# Altium project sonata-board.PrjPcb (part 3 of 4)

## Sheet sb-sonata-fpgaio2.SchDoc: IO Banks 15 + 16
size Letter; Organization: NewAE Technology Inc.; Address1: 1083 Queen St., Suite 196; Address2: Halifax; Address3: NS; Address4: Canada B3H 0B2; SheetNumber: 13; SheetTotal: 20; SheetApproved: NO
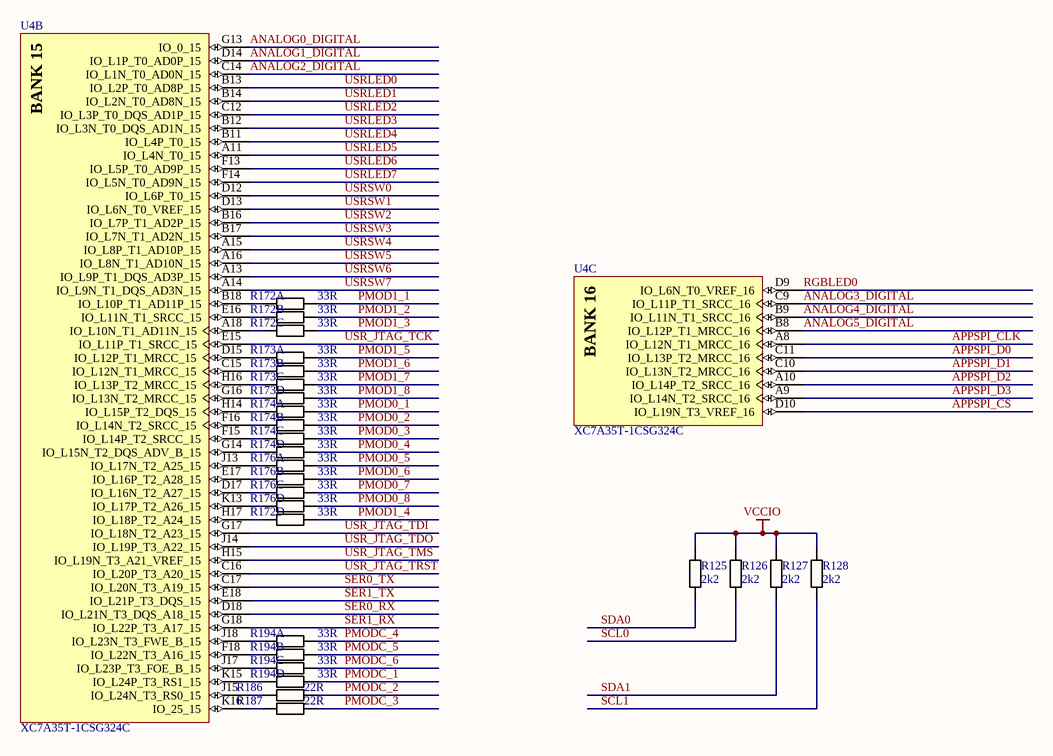
[diagram p12: sb-sonata-fpgaio2.SchDoc]

### Parts
R125  2k2  [RESC1608X55N]
R126  2k2  [RESC1608X55N]
R127  2k2  [RESC1608X55N]
R128  2k2  [RESC1608X55N]
R172  33R  [741C083]  (parts A,B,C,D of 4)
R173  33R  [741C083]  (parts A,B,C,D of 4)
R174  33R  [741C083]  (parts A,B,C,D of 4)
R176  33R  [741C083]  (parts A,B,C,D of 4)
R186  22R  [RESC1005X40N]
R187  22R  [RESC1005X40N]
R194  33R  [741C083]  (parts A,B,C,D of 4)
U4  XC7A35T-1CSG324C  [CSG324]  (parts B,C of 9)

### Nets
VCCIO: R125.1 R126.1 R127.1 R128.1  [project net 3V3_FTDI]
ANALOG0_DIGITAL: U4.G13(IO_0_15)
ANALOG1_DIGITAL: U4.D14(IO_L1P_T0_AD0P_15)
ANALOG2_DIGITAL: U4.C14(IO_L1N_T0_AD0N_15)
ANALOG3_DIGITAL: U4.C9(IO_L11P_T1_SRCC_16)
ANALOG4_DIGITAL: U4.B9(IO_L11N_T1_SRCC_16)
ANALOG5_DIGITAL: U4.B8(IO_L12P_T1_MRCC_16)
APPSPI_CLK: U4.A8(IO_L12N_T1_MRCC_16)
APPSPI_CS: U4.D10(IO_L19N_T3_VREF_16)
APPSPI_D0: U4.C11(IO_L13P_T2_MRCC_16)
APPSPI_D1: U4.C10(IO_L13N_T2_MRCC_16)
APPSPI_D2: U4.A10(IO_L14P_T2_SRCC_16)
APPSPI_D3: U4.A9(IO_L14N_T2_SRCC_16)
PMOD0_1: R174.1B
PMOD0_2: R174.2B
PMOD0_3: R174.3B
PMOD0_4: R174.4B
PMOD0_5: R176.1B
PMOD0_6: R176.2B
PMOD0_7: R176.3B
PMOD0_8: R176.4B
PMOD1_1: R172.1B
PMOD1_2: R172.2B
PMOD1_3: R172.3B
PMOD1_4: R172.4B
PMOD1_5: R173.1B
PMOD1_6: R173.2B
PMOD1_7: R173.3B
PMOD1_8: R173.4B
PMODC_1: R194.4B
PMODC_2: R186.2
PMODC_3: R187.2
PMODC_4: R194.1B
PMODC_5: R194.2B
PMODC_6: R194.3B
RGBLED0: U4.D9(IO_L6N_T0_VREF_16)
SCL0: R126.2
SCL1: R128.2
SDA0: R125.2
SDA1: R127.2
SER0_RX: U4.D18(IO_L21N_T3_DQS_A18_15)
SER0_TX: U4.C17(IO_L20N_T3_A19_15)
SER1_RX: U4.G18(IO_L22P_T3_A17_15)
SER1_TX: U4.E18(IO_L21P_T3_DQS_15)
USR_JTAG_TCK: U4.E15(IO_L11P_T1_SRCC_15)
USR_JTAG_TDI: U4.G17(IO_L18N_T2_A23_15)
USR_JTAG_TDO: U4.J14(IO_L19P_T3_A22_15)
USR_JTAG_TMS: U4.H15(IO_L19N_T3_A21_VREF_15)
USR_JTAG_TRST: U4.C16(IO_L20P_T3_A20_15)
USRLED0: U4.B13(IO_L2P_T0_AD8P_15)
USRLED1: U4.B14(IO_L2N_T0_AD8N_15)
USRLED2: U4.C12(IO_L3P_T0_DQS_AD1P_15)
USRLED3: U4.B12(IO_L3N_T0_DQS_AD1N_15)
USRLED4: U4.B11(IO_L4P_T0_15)
USRLED5: U4.A11(IO_L4N_T0_15)
USRLED6: U4.F13(IO_L5P_T0_AD9P_15)
USRLED7: U4.F14(IO_L5N_T0_AD9N_15)
USRSW0: U4.D12(IO_L6P_T0_15)
USRSW1: U4.D13(IO_L6N_T0_VREF_15)
USRSW2: U4.B16(IO_L7P_T1_AD2P_15)
USRSW3: U4.B17(IO_L7N_T1_AD2N_15)
USRSW4: U4.A15(IO_L8P_T1_AD10P_15)
USRSW5: U4.A16(IO_L8N_T1_AD10N_15)
USRSW6: U4.A13(IO_L9P_T1_DQS_AD3P_15)
USRSW7: U4.A14(IO_L9N_T1_DQS_AD3N_15)
NetR172_1A: R172.1A U4.B18(IO_L10P_T1_AD11P_15)
NetR172_2A: R172.2A U4.E16(IO_L11N_T1_SRCC_15)
NetR172_3A: R172.3A U4.A18(IO_L10N_T1_AD11N_15)
NetR172_4A: R172.4A U4.H17(IO_L18P_T2_A24_15)
NetR173_1A: R173.1A U4.D15(IO_L12P_T1_MRCC_15)
NetR173_2A: R173.2A U4.C15(IO_L12N_T1_MRCC_15)
NetR173_3A: R173.3A U4.H16(IO_L13P_T2_MRCC_15)
NetR173_4A: R173.4A U4.G16(IO_L13N_T2_MRCC_15)
NetR174_1A: R174.1A U4.H14(IO_L15P_T2_DQS_15)
NetR174_2A: R174.2A U4.F16(IO_L14N_T2_SRCC_15)
NetR174_3A: R174.3A U4.F15(IO_L14P_T2_SRCC_15)
NetR174_4A: R174.4A U4.G14(IO_L15N_T2_DQS_ADV_B_15)
NetR176_1A: R176.1A U4.J13(IO_L17N_T2_A25_15)
NetR176_2A: R176.2A U4.E17(IO_L16P_T2_A28_15)
NetR176_3A: R176.3A U4.D17(IO_L16N_T2_A27_15)
NetR176_4A: R176.4A U4.K13(IO_L17P_T2_A26_15)
NetR186_1: R186.1 U4.J15(IO_L24N_T3_RS0_15)
NetR187_1: R187.1 U4.K16(IO_25_15)
NetR194_1A: R194.1A U4.J18(IO_L23N_T3_FWE_B_15)
NetR194_2A: R194.2A U4.F18(IO_L22N_T3_A16_15)
NetR194_3A: R194.3A U4.J17(IO_L23P_T3_FOE_B_15)
NetR194_4A: R194.4A U4.K15(IO_L24P_T3_RS1_15)

### Notes on the sheet
- Title:
- Date:
- Rev:
- Time:
- Project:
- Sheet
- of
- License:
- Copyright © NewAE Technology Inc.
- Approved:
- NewAE.com
- File:
- (in symbol CMP-0383-00012-1, part B) BANK 15
- (in symbol CMP-0383-00012-1, part C) BANK 16

### Library data of the parts
R125-R128 = RCHIP-2K2-0603: 2k2 res, 0603, 1%, 1/10W; Manufacture 1: Yageo; Manufacture Part Number 1: RC0603FR-072K2L; Component Group: Resistor; Case-EIA: 0603; Case-Metric: 1608; Rated Power: 0.1W; Rated Voltage: 75VDC; Part Number: RCHIP-2K2-0603; Footprint: 0603; Pin Count: 2; Supplier 1: Digi-Key; Supplier Part Number 1: 311-2.20KHRCT-ND; Value: 2k2; Tolerance: 1%; Mounting Technology: SMT; Temperature Range: -55C to 155C; Component Kind: Standard; Component Type: Standard
R172-R174 R176 R194 = 741C083330JP: 33-ohm, 0.5mm res array; Manufacture 1: CTS; Component Group: Resistor; PP Material Stack: 0; Part Number: 741C083330JP; Manufacture Part Number 1: 741C083330JP; Pin Count: 8; Supplier 1: Digi-Key; Supplier Part Number 1: 741C083330JPCT-ND; Mounting Technology: SMT; Component Kind: Standard; Component Type: Standard; PP Rotation: 0; PP Rotation1: 0
R186 R187 = RCHIP-22R-0402: as R47-R52 on sheet sb-sonata-fpgaio1; Part Number: RCHIP-22R-0402; Footprint: 0402; Pin Count: 2; Supplier 1: Digi-Key; Supplier Part Number 1: 311-22.0LRCT-ND; Value: 22R; Tolerance: 1%; Mounting Technology: SMT; Temperature Range: -55C to 155C; Component Kind: Standard; Component Type: Standard
U4 = CMP-0383-00012-1: Artix-7 FPGA, 210 User I/Os, 0 GTP, 324-Ball BGA, Speed Grade 1, Commercial Grade, Pb-Free; Manufacturer: Xilinx; GTP: 0; Available User I/O: 210; Speed Grades: 1; Logic Cells: 33280; Total Block RAM: 1800 Kb; CMTs: 5; Maximum Distributed RAM: 400 Kb; ComponentLink2URL: http://www.xilinx.com/support/documentation/data_sheets/ds180_7Series_Overview.pdf; ComponentLink2Description: Datasheet; DatasheetVersion: Rev. 1.15; PackageDescription: 324-Ball Wire-Bond Chip-Scale BGA, Body 15 x 15 mm, Pitch 0.8 mm; ComponentLink4URL: http://www.xilinx.com/support/documentation/user_guides/ug475_7Series_Pkg_Pinout.pdf; PackageReference: CSG-324; Mounting Technology: Surface Mount; PackageVersion: Rev. 1.11; ComponentLink1Description: Manufacturer URL; ComponentLink3Description: Pinout; ComponentLink1URL: http://www.xilinx.com/; ComponentLink3URL: http://www.xilinx.com/support/documentation/user_guides/ug475_7Series_Pkg_Pinout.pdf; PartNumber: XC7A35T-1CSG324C; ComponentLink4Description: Package Specification; Operating Temperature Range: Commercial

## Sheet sb-sonata-fpgapwr.SchDoc: <Enter Sheet Title>
size Letter; Organization: NewAE Technology Inc.; Address1: 1083 Queen St., Suite 196; Address2: Halifax; Address3: NS; Address4: Canada B3H 0B2; SheetNumber: 14; SheetTotal: 20; SheetApproved: YES
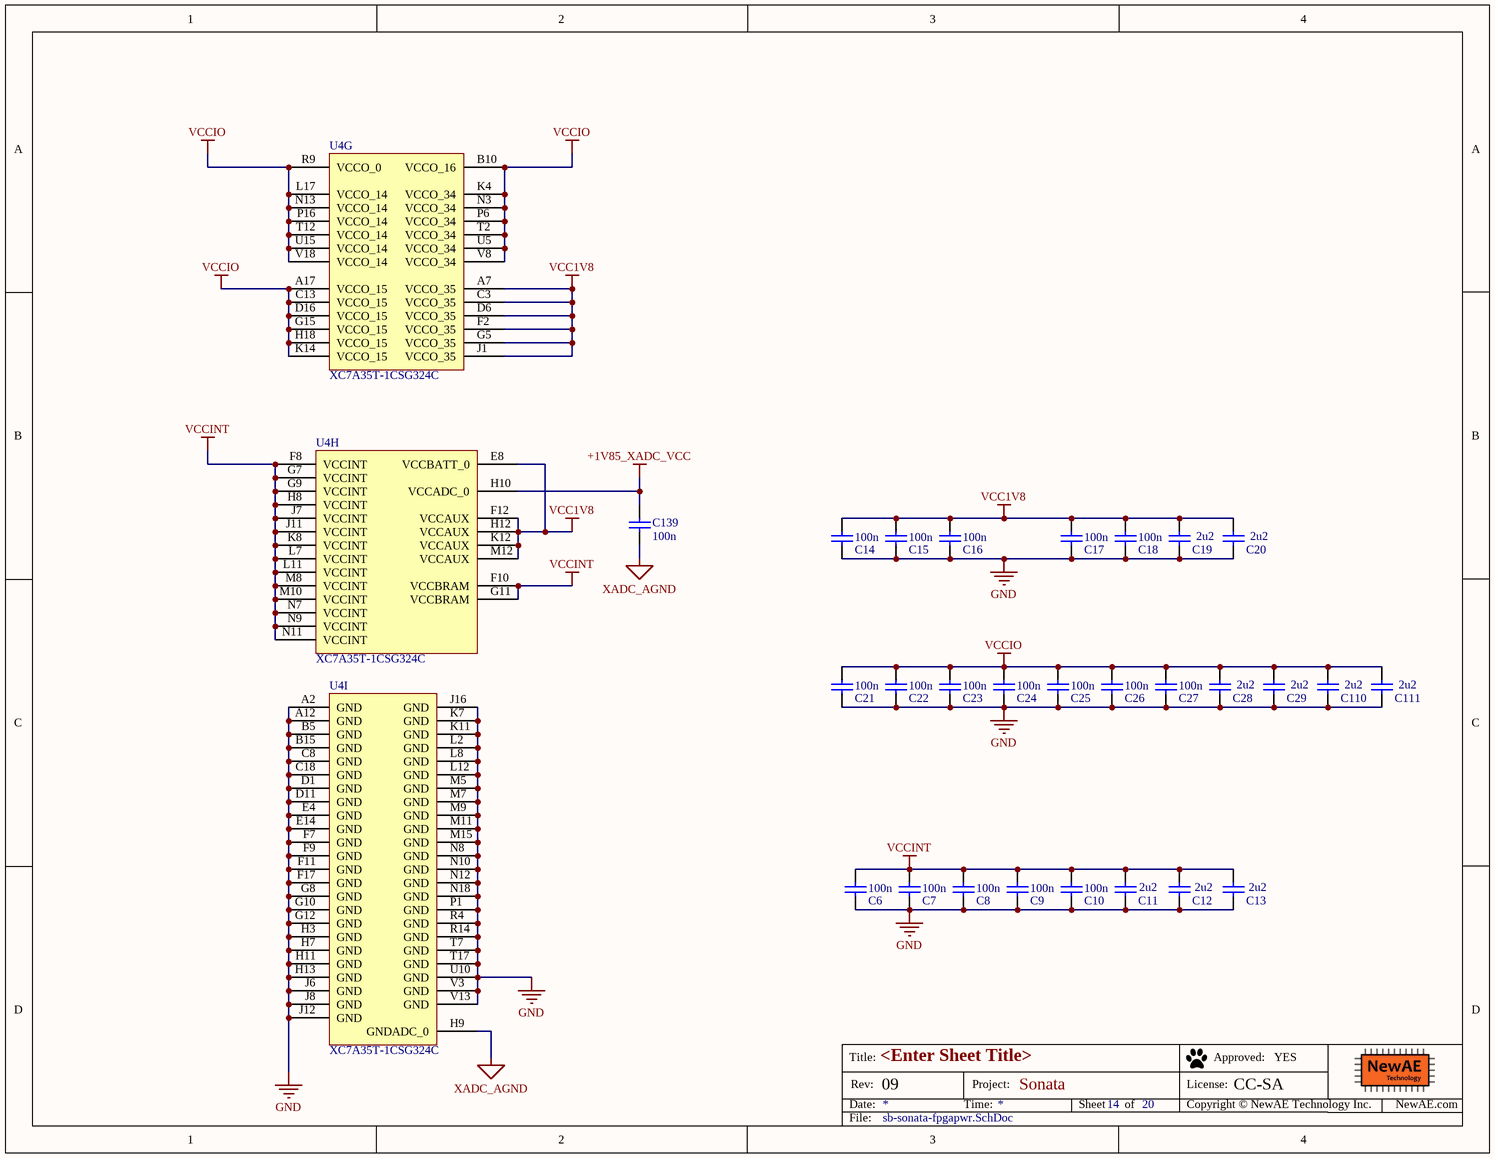
[diagram p13: sb-sonata-fpgapwr.SchDoc]

### Parts
C6  100n  [CAPC0402_M]
C7  100n  [CAPC0402_M]
C8  100n  [CAPC0402_M]
C9  100n  [CAPC0402_M]
C10  100n  [CAPC0402_M]
C11  2u2  [CAPC0603_M]
C12  2u2  [CAPC0603_M]
C13  2u2  [CAPC0603_M]
C14  100n  [CAPC0402_M]
C15  100n  [CAPC0402_M]
C16  100n  [CAPC0402_M]
C17  100n  [CAPC0402_M]
C18  100n  [CAPC0402_M]
C19  2u2  [CAPC0603_M]
C20  2u2  [CAPC0603_M]
C21  100n  [CAPC0402_M]
C22  100n  [CAPC0402_M]
C23  100n  [CAPC0402_M]
C24  100n  [CAPC0402_M]
C25  100n  [CAPC0402_M]
C26  100n  [CAPC0402_M]
C27  100n  [CAPC0402_M]
C28  2u2  [CAPC0603_M]
C29  2u2  [CAPC0603_M]
C110  2u2  [CAPC0603_M]
C111  2u2  [CAPC0603_M]
C139  100n  [CAPC0402_M]
U4  XC7A35T-1CSG324C  [CSG324]  (parts G,H,I of 9)

### Nets
+1V85_XADC_VCC: C139.1 U4.H10(VCCADC_0)
GND: C6.2 C7.2 C8.2 C9.2 C10.2 C11.2 C12.2 C13.2 C14.2 C15.2 C16.2 C17.2 C18.2 C19.2 C20.2 C21.2 C22.2 C23.2 C24.2 C25.2 C26.2 C27.2 C28.2 C29.2 C110.2 C111.2 C139.2 U4.A2(GND) U4.A12(GND) U4.B5(GND) U4.B15(GND) U4.C8(GND) U4.C18(GND) U4.D1(GND) U4.D11(GND) U4.E4(GND) U4.E14(GND) U4.F7(GND) U4.F9(GND) U4.F11(GND) U4.F17(GND) U4.G8(GND) U4.G10(GND) U4.G12(GND) U4.H3(GND) U4.H7(GND) U4.H9(GNDADC_0) U4.H11(GND) U4.H13(GND) U4.J6(GND) U4.J8(GND) U4.J12(GND) U4.J16(GND) U4.K7(GND) U4.K11(GND) U4.L2(GND) U4.L8(GND) U4.L12(GND) U4.M5(GND) U4.M7(GND) U4.M9(GND) U4.M11(GND) U4.M15(GND) U4.N8(GND) U4.N10(GND) U4.N12(GND) U4.N18(GND) U4.P1(GND) U4.R4(GND) U4.R14(GND) U4.T7(GND) U4.T17(GND) U4.U10(GND) U4.V3(GND) U4.V13(GND)  [also labelled XADC_AGND]
VCC1V8: C14.1 C15.1 C16.1 C17.1 C18.1 C19.1 C20.1 U4.A7(VCCO_35) U4.C3(VCCO_35) U4.D6(VCCO_35) U4.E8(VCCBATT_0) U4.F2(VCCO_35) U4.F12(VCCAUX) U4.G5(VCCO_35) U4.H12(VCCAUX) U4.J1(VCCO_35) U4.K12(VCCAUX) U4.M12(VCCAUX)
VCCINT: C6.1 C7.1 C8.1 C9.1 C10.1 C11.1 C12.1 C13.1 U4.F8(VCCINT) U4.F10(VCCBRAM) U4.G7(VCCINT) U4.G9(VCCINT) U4.G11(VCCBRAM) U4.H8(VCCINT) U4.J7(VCCINT) U4.J11(VCCINT) U4.K8(VCCINT) U4.L7(VCCINT) U4.L11(VCCINT) U4.M8(VCCINT) U4.M10(VCCINT) U4.N7(VCCINT) U4.N9(VCCINT) U4.N11(VCCINT)
VCCIO: C21.1 C22.1 C23.1 C24.1 C25.1 C26.1 C27.1 C28.1 C29.1 C110.1 C111.1 U4.A17(VCCO_15) U4.B10(VCCO_16) U4.C13(VCCO_15) U4.D16(VCCO_15) U4.G15(VCCO_15) U4.H18(VCCO_15) U4.K4(VCCO_34) U4.K14(VCCO_15) U4.L17(VCCO_14) U4.N3(VCCO_34) U4.N13(VCCO_14) U4.P6(VCCO_34) U4.P16(VCCO_14) U4.R9(VCCO_0) U4.T2(VCCO_34) U4.T12(VCCO_14) U4.U5(VCCO_34) U4.U15(VCCO_14) U4.V8(VCCO_34) U4.V18(VCCO_14)  [project net 3V3_FTDI]

### Notes on the sheet
- Title:
- Date:
- Rev:
- Time:
- Project:
- Sheet
- of
- License:
- Copyright © NewAE Technology Inc.
- Approved:
- NewAE.com
- File:

### Library data of the parts
C6-C10 C14-C18 C21-C27 C139 = CCHIP-100n-0402: 100n, 0402; Manufacture Part Number 1: CGA2B3X7R1V104K050BB; Component Group: Capacitor; Case-EIA: 0402; Part Number: CCHIP-100n-0402; Footprint: 0402; Pin Count: 2; Value: 100n; Mounting Technology: SMT; Component Kind: Standard; Component Type: Standard; Supplier 1: Digi-Key; Supplier Part Number 1: 445-6901-1-ND
C11-C13 C19 C20 C28 C29 C110 C111 = CCHIP-2u2-0603: 2u2, 0603; Manufacture 1: Samsung; Manufacture Part Number 1: CL10B225KP8NNNC; Component Group: Capacitor; Case-EIA: 0603; Case-Metric: 1608; Rated Voltage: 10VDC; Part Number: CCHIP-2u2-0603; Footprint: 0603; Pin Count: 2; Supplier 1: Digi-Key; Supplier Part Number 1: 1276-1134-2-ND; Value: 2u2; Mounting Technology: SMT; Component Kind: Standard; Component Type: Standard
U4 = CMP-0383-00012-1: as U4 on sheet sb-sonata-fpgaio2; Maximum Distributed RAM: 400 Kb; ComponentLink2URL: http://www.xilinx.com/support/documentation/data_sheets/ds180_7Series_Overview.pdf; ComponentLink2Description: Datasheet; DatasheetVersion: Rev. 1.15; PackageDescription: 324-Ball Wire-Bond Chip-Scale BGA, Body 15 x 15 mm, Pitch 0.8 mm; ComponentLink4URL: http://www.xilinx.com/support/documentation/user_guides/ug475_7Series_Pkg_Pinout.pdf; PackageReference: CSG-324; Mounting Technology: Surface Mount; PackageVersion: Rev. 1.11; ComponentLink1Description: Manufacturer URL; ComponentLink3Description: Pinout; ComponentLink1URL: http://www.xilinx.com/; ComponentLink3URL: http://www.xilinx.com/support/documentation/user_guides/ug475_7Series_Pkg_Pinout.pdf; PartNumber: XC7A35T-1CSG324C; ComponentLink4Description: Package Specification; Operating Temperature Range: Commercial

## Sheet sb-sonata-fpganaalog.SchDoc: FPGA Analog + 1.8V Bank
size Letter; Organization: NewAE Technology Inc.; Address1: 1083 Queen St., Suite 196; Address2: Halifax; Address3: NS; Address4: Canada B3H 0B2; SheetNumber: 15; SheetTotal: 19; SheetApproved: NO
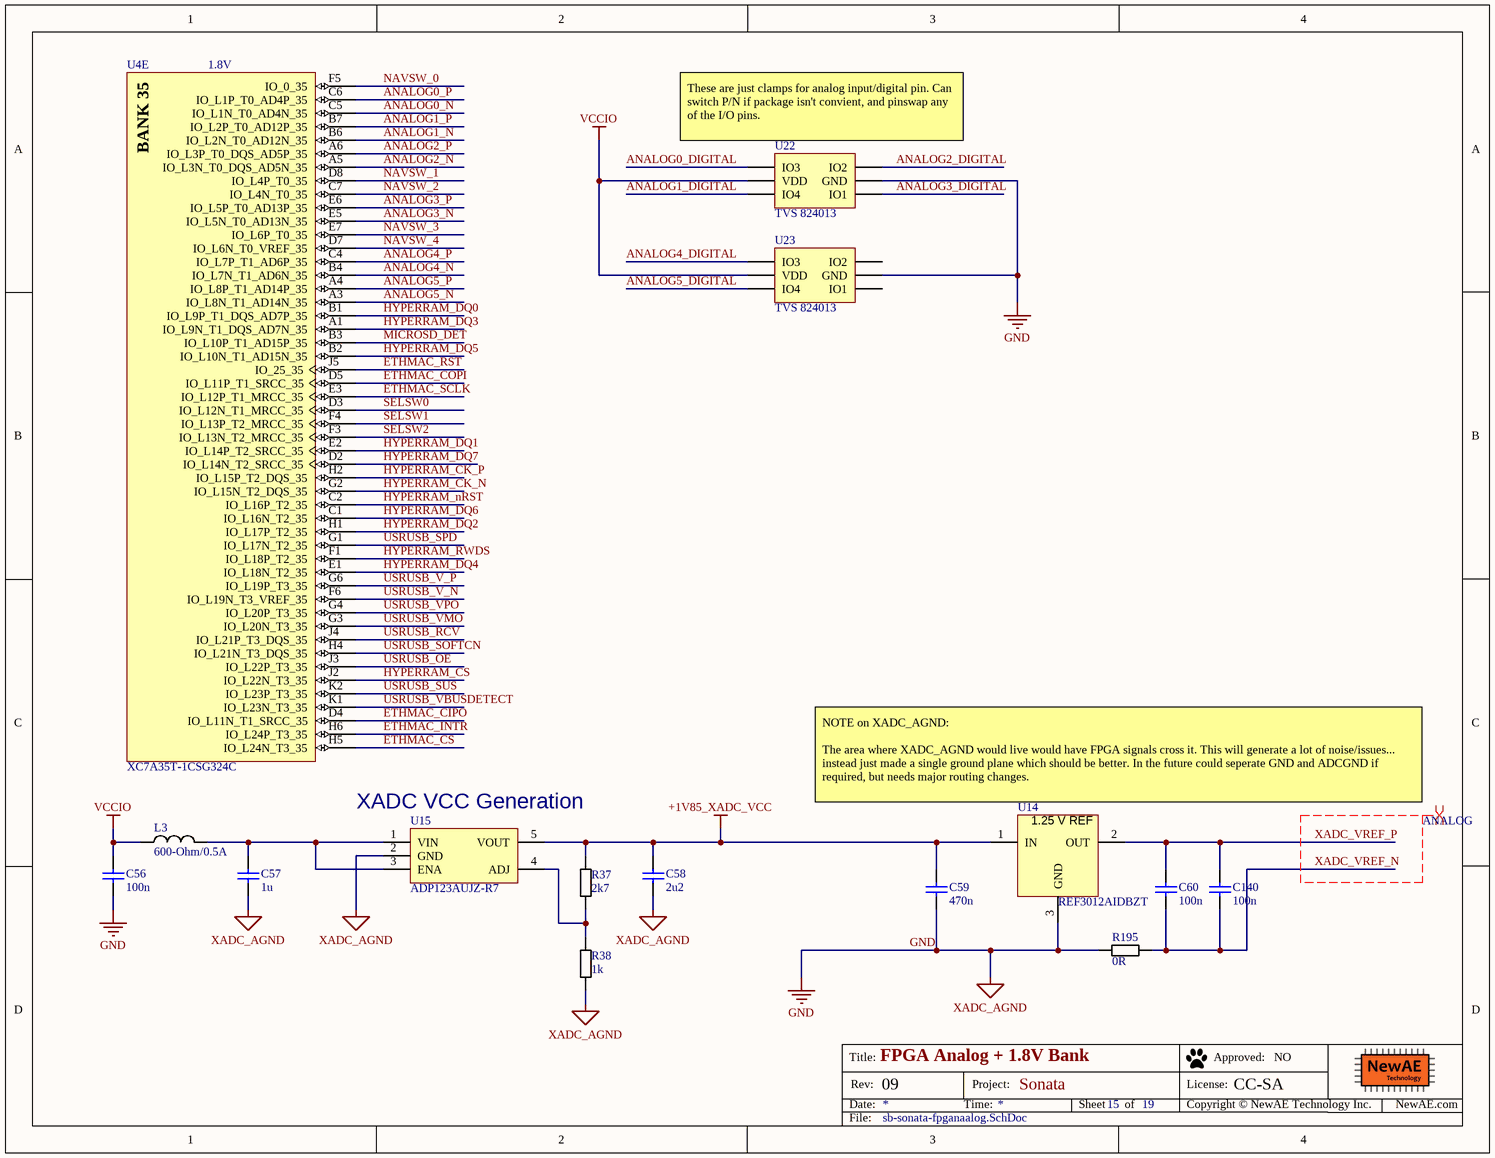
[diagram p14: sb-sonata-fpganaalog.SchDoc]

### Parts
C56  100n  [CAPC0402_M]
C57  1u  [CAPC0603_M]
C58  2u2  [CAPC0603_M]
C59  470n  [CAPC0603_M]
C60  100n  [CAPC0402_M]
C140  100n  [CAPC0402_M]
L3  600-Ohm/0.5A  [IND_0603]
R37  2k7  [RESC1005X40N]
R38  1k  [RESC1005X40N]
R195  0R  [RESC1005X40N]
U4  XC7A35T-1CSG324C  [CSG324]  (part E of 9)
U14  REF3012AIDBZT  [SOT95P237X112-3N]
U15  Linear Voltage Regulator IC  1 Output  300mA TSOT-5  [SOT23-5P95_285X145L45X40]  (value not drawn)
U22  TVS 824013  [SOT95P280X145-6N]
U23  TVS 824013  [SOT95P280X145-6N]

### Nets
+1V85_XADC_VCC: C58.1 C59.1 R37.1 U14.1(IN) U15.5(VOUT)
GND: C56.2 C57.2 C58.2 C59.2 R38.2 R195.1 U14.3(GND) U15.2(GND) U22.2(GND) U23.2(GND)  [also labelled XADC_AGND]
VCCIO: C56.1 L3.1 U22.5(VDD) U23.5(VDD)  [project net 3V3_FTDI]
ANALOG0_DIGITAL: U22.4(IO3)
ANALOG0_N: U4.C5(IO_L1N_T0_AD4N_35)
ANALOG0_P: U4.C6(IO_L1P_T0_AD4P_35)
ANALOG1_DIGITAL: U22.6(IO4)
ANALOG1_N: U4.B6(IO_L2N_T0_AD12N_35)
ANALOG1_P: U4.B7(IO_L2P_T0_AD12P_35)
ANALOG2_DIGITAL: U22.3(IO2)
ANALOG2_N: U4.A5(IO_L3N_T0_DQS_AD5N_35)
ANALOG2_P: U4.A6(IO_L3P_T0_DQS_AD5P_35)
ANALOG3_DIGITAL: U22.1(IO1)
ANALOG3_N: U4.E5(IO_L5N_T0_AD13N_35)
ANALOG3_P: U4.E6(IO_L5P_T0_AD13P_35)
ANALOG4_DIGITAL: U23.4(IO3)
ANALOG4_N: U4.B4(IO_L7N_T1_AD6N_35)
ANALOG4_P: U4.C4(IO_L7P_T1_AD6P_35)
ANALOG5_DIGITAL: U23.6(IO4)
ANALOG5_N: U4.A3(IO_L8N_T1_AD14N_35)
ANALOG5_P: U4.A4(IO_L8P_T1_AD14P_35)
ETHMAC_CIPO: U4.D4(IO_L11N_T1_SRCC_35)
ETHMAC_COPI: U4.D5(IO_L11P_T1_SRCC_35)
ETHMAC_CS: U4.H5(IO_L24N_T3_35)
ETHMAC_INTR: U4.H6(IO_L24P_T3_35)
ETHMAC_RST: U4.J5(IO_25_35)
ETHMAC_SCLK: U4.E3(IO_L12P_T1_MRCC_35)
HYPERRAM_CK_N: U4.G2(IO_L15N_T2_DQS_35)
HYPERRAM_CK_P: U4.H2(IO_L15P_T2_DQS_35)
HYPERRAM_CS: U4.J2(IO_L22N_T3_35)
HYPERRAM_DQ0: U4.B1(IO_L9P_T1_DQS_AD7P_35)
HYPERRAM_DQ1: U4.E2(IO_L14P_T2_SRCC_35)
HYPERRAM_DQ2: U4.H1(IO_L17P_T2_35)
HYPERRAM_DQ3: U4.A1(IO_L9N_T1_DQS_AD7N_35)
HYPERRAM_DQ4: U4.E1(IO_L18N_T2_35)
HYPERRAM_DQ5: U4.B2(IO_L10N_T1_AD15N_35)
HYPERRAM_DQ6: U4.C1(IO_L16N_T2_35)
HYPERRAM_DQ7: U4.D2(IO_L14N_T2_SRCC_35)
HYPERRAM_nRST: U4.C2(IO_L16P_T2_35)
HYPERRAM_RWDS: U4.F1(IO_L18P_T2_35)
MICROSD_DET: U4.B3(IO_L10P_T1_AD15P_35)
NAVSW_0: U4.F5(IO_0_35)
NAVSW_1: U4.D8(IO_L4P_T0_35)
NAVSW_2: U4.C7(IO_L4N_T0_35)
NAVSW_3: U4.E7(IO_L6P_T0_35)
NAVSW_4: U4.D7(IO_L6N_T0_VREF_35)
SELSW0: U4.D3(IO_L12N_T1_MRCC_35)
SELSW1: U4.F4(IO_L13P_T2_MRCC_35)
SELSW2: U4.F3(IO_L13N_T2_MRCC_35)
USRUSB_OE: U4.J3(IO_L22P_T3_35)
USRUSB_RCV: U4.J4(IO_L21P_T3_DQS_35)
USRUSB_SOFTCN: U4.H4(IO_L21N_T3_DQS_35)
USRUSB_SPD: U4.G1(IO_L17N_T2_35)
USRUSB_SUS: U4.K2(IO_L23P_T3_35)
USRUSB_V_N: U4.F6(IO_L19N_T3_VREF_35)
USRUSB_V_P: U4.G6(IO_L19P_T3_35)
USRUSB_VBUSDETECT: U4.K1(IO_L23N_T3_35)
USRUSB_VMO: U4.G3(IO_L20N_T3_35)
USRUSB_VPO: U4.G4(IO_L20P_T3_35)
XADC_VREF_N: C60.2 C140.2 R195.2
XADC_VREF_P: C60.1 C140.1 U14.2(OUT)
NetC57_1: C57.1 L3.2 U15.1(VIN) U15.3(ENA)
NetR37_2: R37.2 R38.1 U15.4(ADJ)

Not connected (* = marked no-connect by the designer): U23 1(IO1) 3(IO2)

### Layout directives
differential pair; differential pair class ANALOG: XADC_VREF_N, XADC_VREF_P

### Notes on the sheet
- 1.8V
- (near U22) These are just clamps for analog input/digital pin. Can switch P/N if package isn't convient, and pinswap any of the I/O pins.
- (near U15) XADC VCC Generation
- (near U14) NOTE on XADC_AGND:
  The area where XADC_AGND would live would have FPGA signals cross it. This will generate a lot of noise/issues... instead just made a single ground plane which should be better. In the future could seperate GND and ADCGND if required, but needs major routing changes.
- Title:
- Date:
- Rev:
- Time:
- Project:
- Sheet
- of
- License:
- Copyright © NewAE Technology Inc.
- Approved:
- NewAE.com
- File:
- (in symbol CMP-0383-00012-1, part E) BANK 35
- (in symbol REF3012AIDBZT) 1.25 V REF

### Library data of the parts
C56 C60 C140 = CCHIP-100n-0402: as C6 on sheet sb-sonata-fpgapwr; Part Number: CCHIP-100n-0402; Footprint: 0402; Pin Count: 2; Value: 100n; Mounting Technology: SMT; Component Kind: Standard; Component Type: Standard; Supplier 1: Digi-Key; Supplier Part Number 1: 445-6901-1-ND
C57 = CCHIP-1u-0603: 1u, 0603, 50V; Manufacture Part Number 1: CL10A105KB8NNNC; Component Group: Capacitor; Case-EIA: 0603; Case-Metric: 1608; Rated Voltage: 50VDC; Part Number: CCHIP-1u-0603; Footprint: 0603; Pin Count: 2; Supplier 1: Digi-Key; Supplier Part Number 1: 1276-1860-1-ND; Value: 1u; Mounting Technology: SMT; Component Kind: Standard; Component Type: Standard
C58 = CCHIP-2u2-0603-25V: 2u2, 0603; Manufacture 1: Murata Electronics North America; Manufacture Part Number 1: GRM188R61E225MA12D; Component Group: Capacitor; Case-EIA: 0603; Case-Metric: 1608; Rated Voltage: 25VDC; Tolerance: ±20%; Part Number: CCHIP-2u2-0603-25V; Footprint: 0603; Pin Count: 2; Supplier 1: Digi-Key; Supplier Part Number 1: 490-12738-1-ND; Value: 2u2; Mounting Technology: SMT; RoHS: Yes; Component Kind: Standard; Component Type: Standard
C59 = CCHIP-470n-0603-50V: 470n, 0603, 50V; Manufacture 1: Taiyo Yuden; Manufacture Part Number 1: UMK107B7474KA-TR; Component Group: Capacitor; Case-EIA: 0603; Rated Voltage: 50VDC; Part Number: CCHIP-470n-0603-50V; Footprint: 0603; Pin Count: 2; Supplier 1: Digi-Key; Supplier Part Number 1: 587-3170-1-ND; Value: 470n; Mounting Technology: SMT; RoHS: Yes; Temperature Range: -55C to 125C; Component Kind: Standard; Component Type: Standard
L3 = FBCHIP-600R-0603: 600 Ohm @ 100 MHz, 0.5A rated FB; Manufacture 1: Murata Electronics; Manufacture Part Number 1: BLM18AG601SN1D; Component Group: Inductor; Value: 600R/0.5A; Case-EIA: 0603; Case-Metric: 1608; PP Material Stack: 0; Part Number: FBCHIP-600R-0603; Footprint: 0603; Pin Count: 2; Supplier 1: Digi-Key; Supplier Part Number 1: 490-1014-2-ND; Rated Power: 0.5A; Component Kind: Standard; Component Type: Standard; PP Rotation: 0
R37 = RCHIP-2K7-0402: 2k7 res, 0402, 1%, 1/16W; Manufacture 1: Yageo; Manufacture Part Number 1: RC0402FR-072K7L; Component Group: Resistor; Case-EIA: 0402; Case-Metric: 1005; Rated Power: 0.063W; Rated Voltage: 75VDC; Part Number: RCHIP-2K7-0402; Footprint: 0402; Pin Count: 2; Supplier 1: Digi-Key; Supplier Part Number 1: 311-2.70KLRCT-ND; Value: 2k7; Tolerance: 1%; Mounting Technology: SMT; Temperature Range: -55C to 155C; Component Kind: Standard; Component Type: Standard
R38 = RCHIP-1K-0402: 1k res, 0402, 1%, 1/16W; Manufacture 1: Yageo; Manufacture Part Number 1: RC0402FR-071KL; Component Group: Resistor; Case-EIA: 0402; Case-Metric: 1005; Rated Power: 0.063W; Rated Voltage: 75VDC; Part Number: RCHIP-1K-0402; Footprint: 0402; Pin Count: 2; Supplier 1: Digi-Key; Supplier Part Number 1: 311-1.00KLRCT-ND; Value: 1k; Tolerance: 1%; Mounting Technology: SMT; Temperature Range: -55C to 155C; Component Kind: Standard; Component Type: Standard
R195 = RCHIP-0R-0402: 2 ohm; Manufacture 1: Yageo; Manufacture Part Number 1: RC0402FR-070RL; Component Group: Resistor; Case-EIA: 0402; Case-Metric: 1005; Part Number: RCHIP-0R-0402; Footprint: 0402; Pin Count: 2; Supplier 1: Digi-Key; Supplier Part Number 1: 311-0.0LRCT-ND; Value: 0R; Component Kind: Standard; Component Type: Standard
U4 = CMP-0383-00012-1: as U4 on sheet sb-sonata-fpgaio2; Maximum Distributed RAM: 400 Kb; ComponentLink2URL: http://www.xilinx.com/support/documentation/data_sheets/ds180_7Series_Overview.pdf; ComponentLink2Description: Datasheet; DatasheetVersion: Rev. 1.15; PackageDescription: 324-Ball Wire-Bond Chip-Scale BGA, Body 15 x 15 mm, Pitch 0.8 mm; ComponentLink4URL: http://www.xilinx.com/support/documentation/user_guides/ug475_7Series_Pkg_Pinout.pdf; PackageReference: CSG-324; Mounting Technology: Surface Mount; PackageVersion: Rev. 1.11; ComponentLink1Description: Manufacturer URL; ComponentLink3Description: Pinout; ComponentLink1URL: http://www.xilinx.com/; ComponentLink3URL: http://www.xilinx.com/support/documentation/user_guides/ug475_7Series_Pkg_Pinout.pdf; PartNumber: XC7A35T-1CSG324C; ComponentLink4Description: Package Specification; Operating Temperature Range: Commercial
U14 = REF3012AIDBZT: IC VREF SERIES 0.2% SOT23-3; Manufacture 1: Texas Instruments; Output Voltage: 1.25V; Max Input Voltage: 5.5V; Max Output Current: 25mA; Min Input Voltage: 1.8V; Nominal Supply Current: 42uA; Temperature Coefficient: 50ppm/°C; Number of Channels: 1; Quiescent Current: 50uA; Min Output Voltage: 1.248V; Reference Type: Series,Fixed; Component Group: Analog IC; PP Material Stack: 0; Supplier 1: Digi-Key; RoHS: Yes; Category: Voltage References; Stock 1: 7831; Pricing 1: 1=1.18000, 10=1.05300, 25=0.99960, 100=0.76760 (USD); Case/Package: SOT-23; Number of Pins: 3; Min Operating Temperature: -40°C; Max Operating Temperature: 125°C; Packaging: Tape and Reel; Package Quantity: 1; Output Current: 25mA; Max Supply Current: 50uA; Max Output Voltage: 1.25V; Reference Voltage: 1.25V; Termination: SMD/SMT; Length: 2.92mm; Width: 1.3mm; Height: 1mm; Radiation Hardening: No; REACH SVHC: No SVHC; Lead Free: Lead Free; ComponentLink3URL: https://datasheet.ciiva.com/2007/ref3012-2007154.pdf?src-supplier=Digi-Key; ComponentLink3Description: https://datasheet.ciiva.com/2007/ref3012-2007154.pdf?src-supplier=Digi-Key; ComponentLink4URL: https://datasheet.ciiva.com/2007/ref3012-2007155.pdf?src-supplier=Digi-Key; ComponentLink4Description: https://datasheet.ciiva.com/2007/ref3012-2007155.pdf?src-supplier=Digi-Key; ComponentLink5URL: https://datasheet.ciiva.com/3235/ref3033-3235533.pdf?src-supplier=Avnet; ComponentLink5Description: https://datasheet.ciiva.com/3235/ref3033-3235533.pdf?src-supplier=Avnet; ComponentLink6URL: https://datasheet.ciiva.com/3235/ref3033-3235534.pdf?src-supplier=Avnet; ComponentLink6Description: https://datasheet.ciiva.com/3235/ref3033-3235534.pdf?src-supplier=Avnet; .Checked SCH: *; .Checked PCB: *; Supplier Part Number 1: REF3012AIDBZTTR-ND; Manufacturer Part Number: REF3012AIDBZT; Part Number: REF3012AIDBZT; Footprint: SOT23-3; Manufacture Part Number 1: REF3012AIDBZT; Pin Count: 3; Mounting Technology: SMT; Component Kind: Standard; Component Type: Standard; PP Rotation: 0
U15 = ADP123AUJZ-R7: IC REG LIN POS ADJ 300MA TSOT5; Manufacture 1: Analog Devices Inc.; Dropout Voltage: 85mV; Output Voltage: 5V; Number of Outputs: 1; Max Input Voltage: 5.5V; Min Input Voltage: 2.3V; Min Current Limit: 350mA; Polarity: Positive; Quiescent Current: 45uA; Reference Voltage: 500mV; Min Output Voltage: 800mV; Accuracy: 1%; Power Supply Rejection Ratio (PSRR): 60dB; Max Supply Current: 170uA; Output Type: Adjustable; Component Group: Analog IC; PP Material Stack: 0; Supplier 1: Digi-Key; Category: Voltage Regulators - Linear; Stock 1: 14167; Pricing 1: 1=1.16000, 10=1.03300, 25=0.98000, 100=0.75250, 250=0.66500, 500=0.63000, 1000=0.49000 (USD); Case/Package: TSOT; Number of Pins: 5; Contact Plating: Tin,Matte; Min Operating Temperature: -40°C; Max Operating Temperature: 125°C; Output Current: 300mA; Max Output Current: 300mA; Packaging: Tape and Reel; Number of Regulators: 1; Max Output Voltage: 5V; Output Voltage Accuracy: 1%; Nominal Supply Current: 45uA; Operating Supply Current: 45uA; Length: 2.9mm; Width: 1.6mm; Height: 0.9mm; REACH SVHC: No SVHC; Lead Free: Contains Lead; ComponentLink3URL: https://datasheet.ciiva.com/2040/adp122-123-2040698.pdf?src-supplier=Digi-Key; ComponentLink3Description: https://datasheet.ciiva.com/2040/adp122-123-2040698.pdf?src-supplier=Digi-Key; ComponentLink4URL: https://datasheet.ciiva.com/2040/adp122-123-2040699.pdf?src-supplier=Digi-Key; ComponentLink4Description: https://datasheet.ciiva.com/2040/adp122-123-2040699.pdf?src-supplier=Digi-Key; Supplier Part Number 1: ADP123AUJZ-R7TR-ND; .Checked SCH: *; .Checked PCB: *; Manufacturer Part Number: ADP123AUJZ-R7; Part Number: ADP123AUJZ-R7; Manufacture Part Number 1: ADP123AUJZ-R7; Pin Count: 5; Mounting Technology: SMT; Component Kind: Standard; Component Type: Standard; PP Rotation: 0; Footprint: SOT23-5
U22 U23 = TVS_4IO_3v3: TVS DIODE 3.3V 6V SOT23-6L; Manufacture 1: Wurth Electronics Inc.; Manufacture Part Number 1: 824013; Component Group: Analog IC; PP Material Stack: 0; Part Number: TVS_4IO_3v3; Footprint: SOT-23-6; Pin Count: 6; Supplier 1: Digi-Key; Supplier Part Number 1: 732-4466-1-ND; Mounting Technology: SMT; RoHS: Yes; Component Kind: Standard; Component Type: Standard; PP Rotation: 0

## Sheet sb-sonata-analoginput.SchDoc: Analog Conversion
size Letter; Organization: NewAE Technology Inc.; Address1: 1083 Queen St., Suite 196; Address2: Halifax; Address3: NS; Address4: Canada B3H 0B2; SheetNumber: 15; SheetTotal: 20; SheetApproved: NO
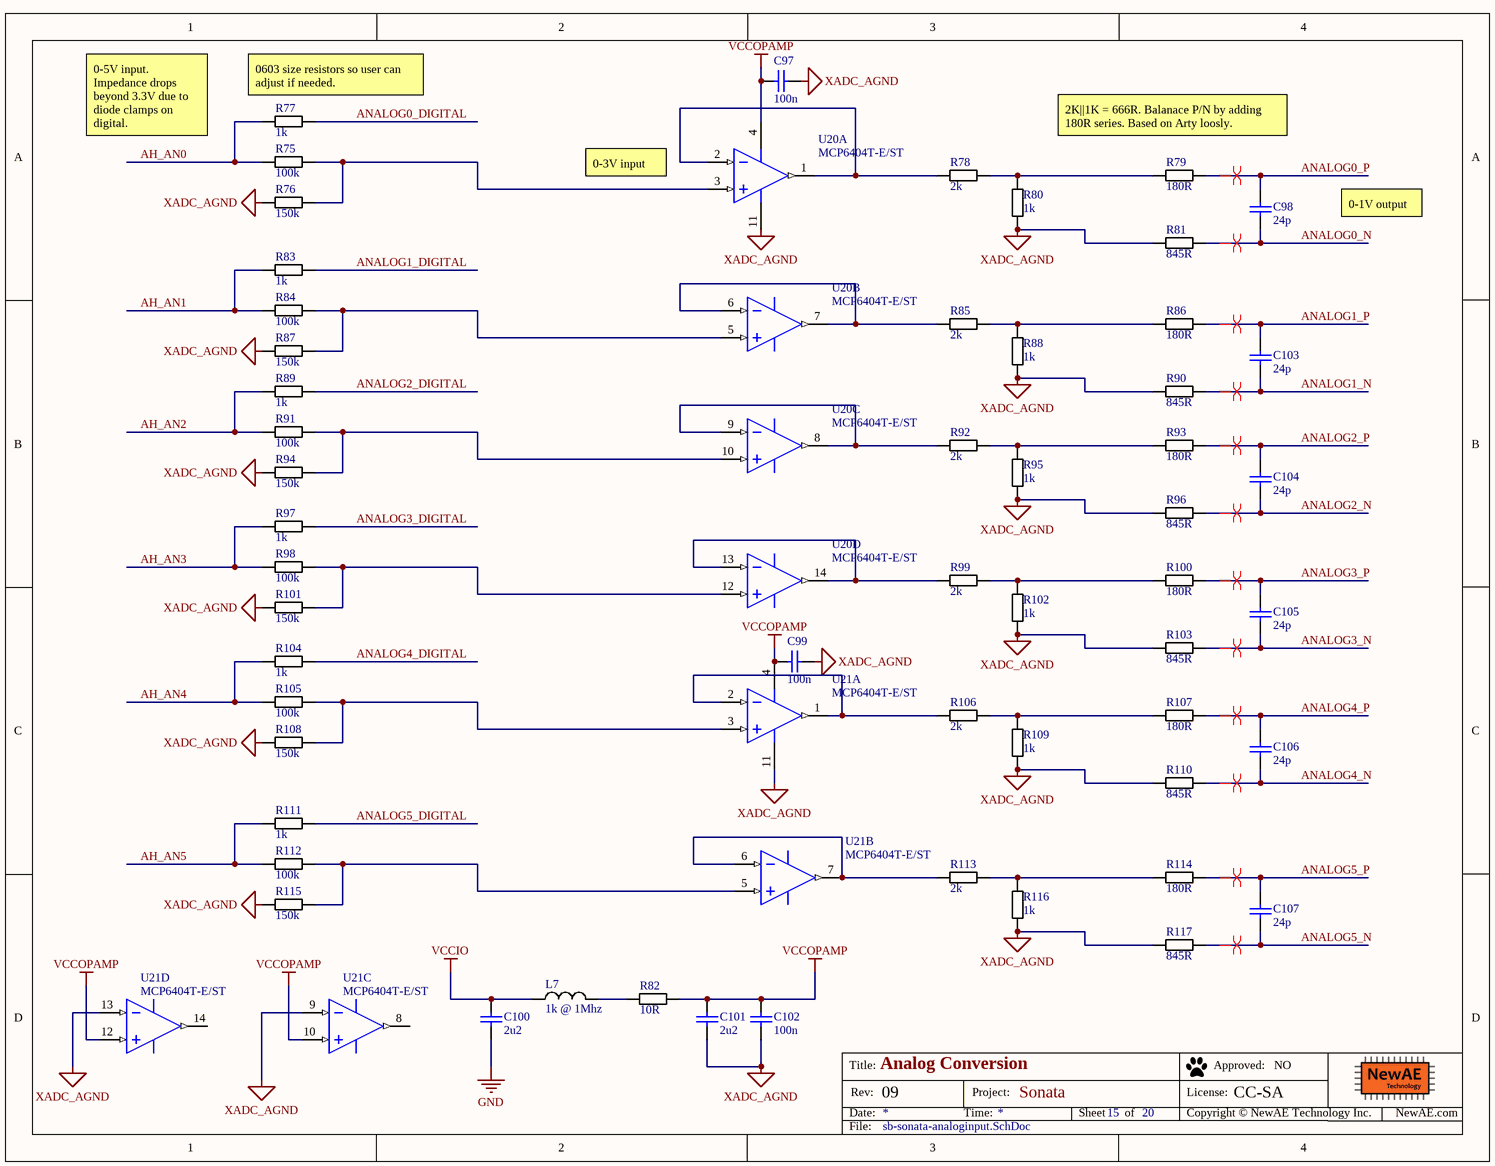
[diagram p15: sb-sonata-analoginput.SchDoc]

### Parts
C97  100n  [CAPC0402_M]
C98  24p  [CAPC0402_M]
C99  100n  [CAPC0402_M]
C100  2u2  [CAPC0603_M]
C101  2u2  [CAPC0603_M]
C102  100n  [CAPC0402_M]
C103  24p  [CAPC0402_M]
C104  24p  [CAPC0402_M]
C105  24p  [CAPC0402_M]
C106  24p  [CAPC0402_M]
C107  24p  [CAPC0402_M]
L7  1k @ 1Mhz  [IND_0603]
R75  100k  [RESC1608X55N]
R76  150k  [RESC1608X55N]
R77  1k  [RESC1608X55N]
R78  2k  [RESC1005X40N]
R79  180R  [RESC1005X40N]
R80  1k  [RESC1005X40N]
R81  845R  [RESC1005X40N]
R82  10R  [RESC1608X55N]
R83  1k  [RESC1608X55N]
R84  100k  [RESC1608X55N]
R85  2k  [RESC1005X40N]
R86  180R  [RESC1005X40N]
R87  150k  [RESC1608X55N]
R88  1k  [RESC1005X40N]
R89  1k  [RESC1608X55N]
R90  845R  [RESC1005X40N]
R91  100k  [RESC1608X55N]
R92  2k  [RESC1005X40N]
R93  180R  [RESC1005X40N]
R94  150k  [RESC1608X55N]
R95  1k  [RESC1005X40N]
R96  845R  [RESC1005X40N]
R97  1k  [RESC1608X55N]
R98  100k  [RESC1608X55N]
R99  2k  [RESC1005X40N]
R100  180R  [RESC1005X40N]
R101  150k  [RESC1608X55N]
R102  1k  [RESC1005X40N]
R103  845R  [RESC1005X40N]
R104  1k  [RESC1608X55N]
R105  100k  [RESC1608X55N]
R106  2k  [RESC1005X40N]
R107  180R  [RESC1005X40N]
R108  150k  [RESC1608X55N]
R109  1k  [RESC1005X40N]
R110  845R  [RESC1005X40N]
R111  1k  [RESC1608X55N]
R112  100k  [RESC1608X55N]
R113  2k  [RESC1005X40N]
R114  180R  [RESC1005X40N]
R115  150k  [RESC1608X55N]
R116  1k  [RESC1005X40N]
R117  845R  [RESC1005X40N]
U20  MCP6404T-E/ST  [TSSOP-ST14_M]  (parts A,B,C,D of 4)
U21  MCP6404T-E/ST  [TSSOP-ST14_M]  (parts A,B,C,D of 4)

### Nets
GND: C97.2 C99.2 C100.2 C101.2 C102.2 R76.1 R80.2 R81.1 R87.1 R88.2 R90.1 R94.1 R95.2 R96.1 R101.1 R102.2 R103.1 R108.1 R109.2 R110.1 R115.1 R116.2 R117.1 U20.11(VSS) U21.9(VINC-) U21.11(VSS) U21.13(VIND-)  [also labelled XADC_AGND]
VCCIO: C100.1 L7.1  [project net 3V3_FTDI]
VCCOPAMP: C97.1 C99.1 C101.1 C102.1 R82.2 U20.4(VDD) U21.4(VDD) U21.10(VINC+) U21.12(VIND+)
AH_AN0: R75.1 R77.1
AH_AN1: R83.1 R84.1
AH_AN2: R89.1 R91.1
AH_AN3: R97.1 R98.1
AH_AN4: R104.1 R105.1
AH_AN5: R111.1 R112.1
ANALOG0_DIGITAL: R77.2
ANALOG0_N: C98.2 R81.2
ANALOG0_P: C98.1 R79.2
ANALOG1_DIGITAL: R83.2
ANALOG1_N: C103.2 R90.2
ANALOG1_P: C103.1 R86.2
ANALOG2_DIGITAL: R89.2
ANALOG2_N: C104.2 R96.2
ANALOG2_P: C104.1 R93.2
ANALOG3_DIGITAL: R97.2
ANALOG3_N: C105.2 R103.2
ANALOG3_P: C105.1 R100.2
ANALOG4_DIGITAL: R104.2
ANALOG4_N: C106.2 R110.2
ANALOG4_P: C106.1 R107.2
ANALOG5_DIGITAL: R111.2
ANALOG5_N: C107.2 R117.2
ANALOG5_P: C107.1 R114.2
NetL7_2: L7.2 R82.1
NetR75_2: R75.2 R76.2 U20.3(VINA+)
NetR78_1: R78.1 U20.1(VOUTA) U20.2(VINA-)
NetR78_2: R78.2 R79.1 R80.1
NetR84_2: R84.2 R87.2 U20.5(VINB+)
NetR85_1: R85.1 U20.6(VINB-) U20.7(VOUTB)
NetR85_2: R85.2 R86.1 R88.1
NetR91_2: R91.2 R94.2 U20.10(VINC+)
NetR92_1: R92.1 U20.8(VOUTC) U20.9(VINC-)
NetR92_2: R92.2 R93.1 R95.1
NetR98_2: R98.2 R101.2 U20.12(VIND+)
NetR99_1: R99.1 U20.13(VIND-) U20.14(VOUTD)
NetR99_2: R99.2 R100.1 R102.1
NetR105_2: R105.2 R108.2 U21.3(VINA+)
NetR106_1: R106.1 U21.1(VOUTA) U21.2(VINA-)
NetR106_2: R106.2 R107.1 R109.1
NetR112_2: R112.2 R115.2 U21.5(VINB+)
NetR113_1: R113.1 U21.6(VINB-) U21.7(VOUTB)
NetR113_2: R113.2 R114.1 R116.1

Not connected (* = marked no-connect by the designer): U21 8(VOUTC) 14(VOUTD)

### Layout directives
differential pair; Parameter 1: ANALOG_DIFF_PAIR: ANALOG0_N, ANALOG0_P, ANALOG1_N, ANALOG1_P, ANALOG2_N, ANALOG2_P, ANALOG3_N, ANALOG3_P, ANALOG4_N, ANALOG4_P, ANALOG5_N, ANALOG5_P

### Notes on the sheet
- (near R77) 0603 size resistors so user can adjust if needed.
- 0-5V input. Impedance drops beyond 3.3V due to diode clamps on digital.
- 0-3V input
- (near R79) 2K||1K = 666R. Balanace P/N by adding 180R series. Based on Arty loosly.
- 0-1V output
- Title:
- Date:
- Rev:
- Time:
- Project:
- Sheet
- of
- License:
- Copyright © NewAE Technology Inc.
- Approved:
- NewAE.com
- File:

### Library data of the parts
C97 C99 C102 = CCHIP-100n-0402: as C6 on sheet sb-sonata-fpgapwr; Part Number: CCHIP-100n-0402; Footprint: 0402; Pin Count: 2; Supplier 1: Digi-Key; Supplier Part Number 1: 445-6901-1-ND; Value: 100n; Mounting Technology: SMT; Component Kind: Standard; Component Type: Standard
C98 C103-C107 = CCHIP-24p-0402: 24p, 0402; Manufacture 1: Murata Electronics; Manufacture Part Number 1: GCM1555C1H240FA16D; Component Group: Capacitor; Case-EIA: 0402; Case-Metric: 1005; Rated Voltage: 50V; Part Number: CCHIP-24p-0402; Footprint: 0402; Pin Count: 2; Supplier 1: Digi-Key; Supplier Part Number 1: 490-GCM1555C1H240FA16DTR-ND; Value: 24p; Mounting Technology: SMT; RoHS: Yes; Component Kind: Standard; Component Type: Standard
C100 C101 = CCHIP-2u2-0603: as C11-C13 on sheet sb-sonata-fpgapwr; Part Number: CCHIP-2u2-0603; Footprint: 0603; Pin Count: 2; Supplier 1: Digi-Key; Supplier Part Number 1: 1276-1134-1-ND; Value: 2u2; Mounting Technology: SMT; Component Kind: Standard; Component Type: Standard
L7 = FBCHIP-1k-0603: Ferrite Beads HI CUR CHIP BD 0603 1000OHMS 25%; Manufacture 1: Taiyo Yuden; Manufacture Part Number 1: FBMH1608HM102-T / FBMH1608HM102-T / FBMH1608HM102-T / FBMH1608HM102-T; Component Group: Inductor; PP Material Stack: 0; Part Number: FBCHIP-1k-0603; Footprint: 0603; Pin Count: 2; Supplier 1: Mouser; Supplier Part Number 1: 963-FBMH1608HM102-T; Mounting Technology: SMT; RoHS: Yes; Component Kind: Standard; Component Type: Standard; PP Rotation: 0
R75 R84 R91 R98 R105 R112 = RCHIP-100K-0603: 100k res, 0603, 1%, 1/10W; Manufacture 1: Yageo; Manufacture Part Number 1: RC0603FR-07100KL; Component Group: Resistor; Case-EIA: 0603; Case-Metric: 1608; Rated Power: 0.1W; Rated Voltage: 75VDC; Part Number: RCHIP-100K-0603; Footprint: 0603; Pin Count: 2; Supplier 1: Digi-Key; Supplier Part Number 1: 311-100KHRCT-ND; Value: 100k; Tolerance: 1%; Mounting Technology: SMT; Temperature Range: -55C to 155C; Component Kind: Standard; Component Type: Standard
R76 R87 R94 R101 R108 R115 = RCHIP-150K-0603: 150k res, 0603, 1%, 1/10W; Manufacture 1: Yageo; Manufacture Part Number 1: RC0603FR-07150KL; Component Group: Resistor; Case-EIA: 0603; Case-Metric: 1608; Rated Power: 0.1W; Rated Voltage: 75VDC; Part Number: RCHIP-150K-0603; Footprint: 0603; Pin Count: 2; Supplier 1: Digi-Key; Supplier Part Number 1: 311-150KHRCT-ND; Value: 150k; Tolerance: 1%; Mounting Technology: SMT; Temperature Range: -55C to 155C; Component Kind: Standard; Component Type: Standard
R77 R83 R89 R97 R104 R111 = RCHIP-1k-0603: 1k res, 0603, 1%, 1/10W; Manufacture 1: Yageo; Manufacture Part Number 1: RC0603FR-071KL; Component Group: Resistor; Case-EIA: 0603; Case-Metric: 1608; Rated Power: 0.1W; Rated Voltage: 75VDC; Part Number: RCHIP-1K-0603; Footprint: 0603; Pin Count: 2; Supplier 1: Digi-Key; Supplier Part Number 1: 311-1.00KHRCT-ND; Value: 1k; Tolerance: 1%; Mounting Technology: SMT; Temperature Range: -55C to 155C; Component Kind: Standard; Component Type: Standard
R78 R85 R92 R99 R106 R113 = RCHIP-2K-0402: 2k res, 0402, 1%, 1/16W; Manufacture 1: Yageo; Manufacture Part Number 1: RC0402FR-072KL; Component Group: Resistor; Case-EIA: 0402; Case-Metric: 1005; Rated Power: 0.063W; Rated Voltage: 75VDC; Part Number: RCHIP-2K-0402; Footprint: 0402; Pin Count: 2; Supplier 1: Digi-Key; Supplier Part Number 1: 311-2KLRCT-ND; Value: 2k; Tolerance: 1%; Mounting Technology: SMT; Temperature Range: -55C to 155C; Component Kind: Standard; Component Type: Standard
R79 R86 R93 R100 R107 R114 = RCHIP-180R-0402: 180R res, 0402, 1%, 1/16W; Manufacture 1: Yageo; Manufacture Part Number 1: RC0402FR-07180RL; Component Group: Resistor; Case-EIA: 0402; Case-Metric: 1005; Rated Power: 0.063W; Rated Voltage: 75VDC; Part Number: RCHIP-180R-0402; Footprint: 0402; Pin Count: 2; Supplier 1: Digi-Key; Supplier Part Number 1: 311-180LRCT-ND; Value: 180R; Tolerance: 1%; Mounting Technology: SMT; Temperature Range: -55C to 155C; Component Kind: Standard; Component Type: Standard
R80 R88 R95 R102 R109 R116 = RCHIP-1K-0402: as R38 on sheet sb-sonata-fpganaalog; Part Number: RCHIP-1K-0402; Footprint: 0402; Pin Count: 2; Supplier 1: Digi-Key; Supplier Part Number 1: 311-1.00KLRCT-ND; Value: 1k; Tolerance: 1%; Mounting Technology: SMT; Temperature Range: -55C to 155C; Component Kind: Standard; Component Type: Standard
R81 R90 R96 R103 R110 R117 = RCHIP-845R-0402: 845R res, 0402, 1%, 1/16W; Manufacture 1: Yageo; Manufacture Part Number 1: RC0402FR-07845RL; Component Group: Resistor; Case-EIA: 0402; Case-Metric: 1005; Rated Power: 0.063W; Rated Voltage: 75VDC; Part Number: RCHIP-845R-0402; Footprint: 0402; Pin Count: 2; Supplier 1: Digi-Key; Supplier Part Number 1: YAG3244CT-ND; Value: 845R; Tolerance: 1%; Mounting Technology: SMT; Temperature Range: -55C to 155C; Component Kind: Standard; Component Type: Standard
R82 = RCHIP-10R-0603: 10R res, 0603, 1%, 1/10W; Manufacture 1: Yageo; Manufacture Part Number 1: RC0603FR-0710RL; Component Group: Resistor; Case-EIA: 0603; Case-Metric: 1608; Rated Power: 0.1W; Rated Voltage: 75VDC; Part Number: RCHIP-10R-0603; Footprint: 0603; Pin Count: 2; Supplier 1: Digi-Key; Supplier Part Number 1: 311-10.0HRCT-ND; Value: 10R; Tolerance: 1%; Mounting Technology: SMT; Temperature Range: -55C to 155C; Component Kind: Standard; Component Type: Standard
U20 U21 = CMP-0187-00805-2: None; Nominal Supply Current: 45uA; Power Supply Rejection Ratio (PSRR): 63dB; Unity Gain Bandwidth Product: 1MHz; Amplifier Type: GENERAL PURPOSE; Voltage Gain: 110dB; Number of Channels: 4; Output Current: 15mA; Max Supply Voltage: 6V; Min Supply Voltage: 1.8V; Slew Rate: 0.5V/µs; Input Bias Current: 100pA; Input Offset Voltage (Vos): 4.5mV; Common Mode Rejection Ratio: 56dB; Number of Pins: 14; Case/Package: TSSOP; Packaging: Tape and Reel; Technology: CMOS; Lead Free: Lead Free; Max Operating Temperature: 125°C; Mount: Surface Mount; Number of Circuits: 4; Number of Elements: 4; Supply Current: 45uA; RoHS Compliant: Yes; Gain Bandwidth Product: 1MHz; Min Operating Temperature: -40°C

## Sheet sb-sonata-psu.SchDoc: Switch-mode PSU
size Letter; Organization: NewAE Technology Inc.; Address1: 1083 Queen St., Suite 196; Address2: Halifax; Address3: NS; Address4: Canada B3H 0B2; SheetNumber: 16; SheetTotal: 19; SheetApproved: NO
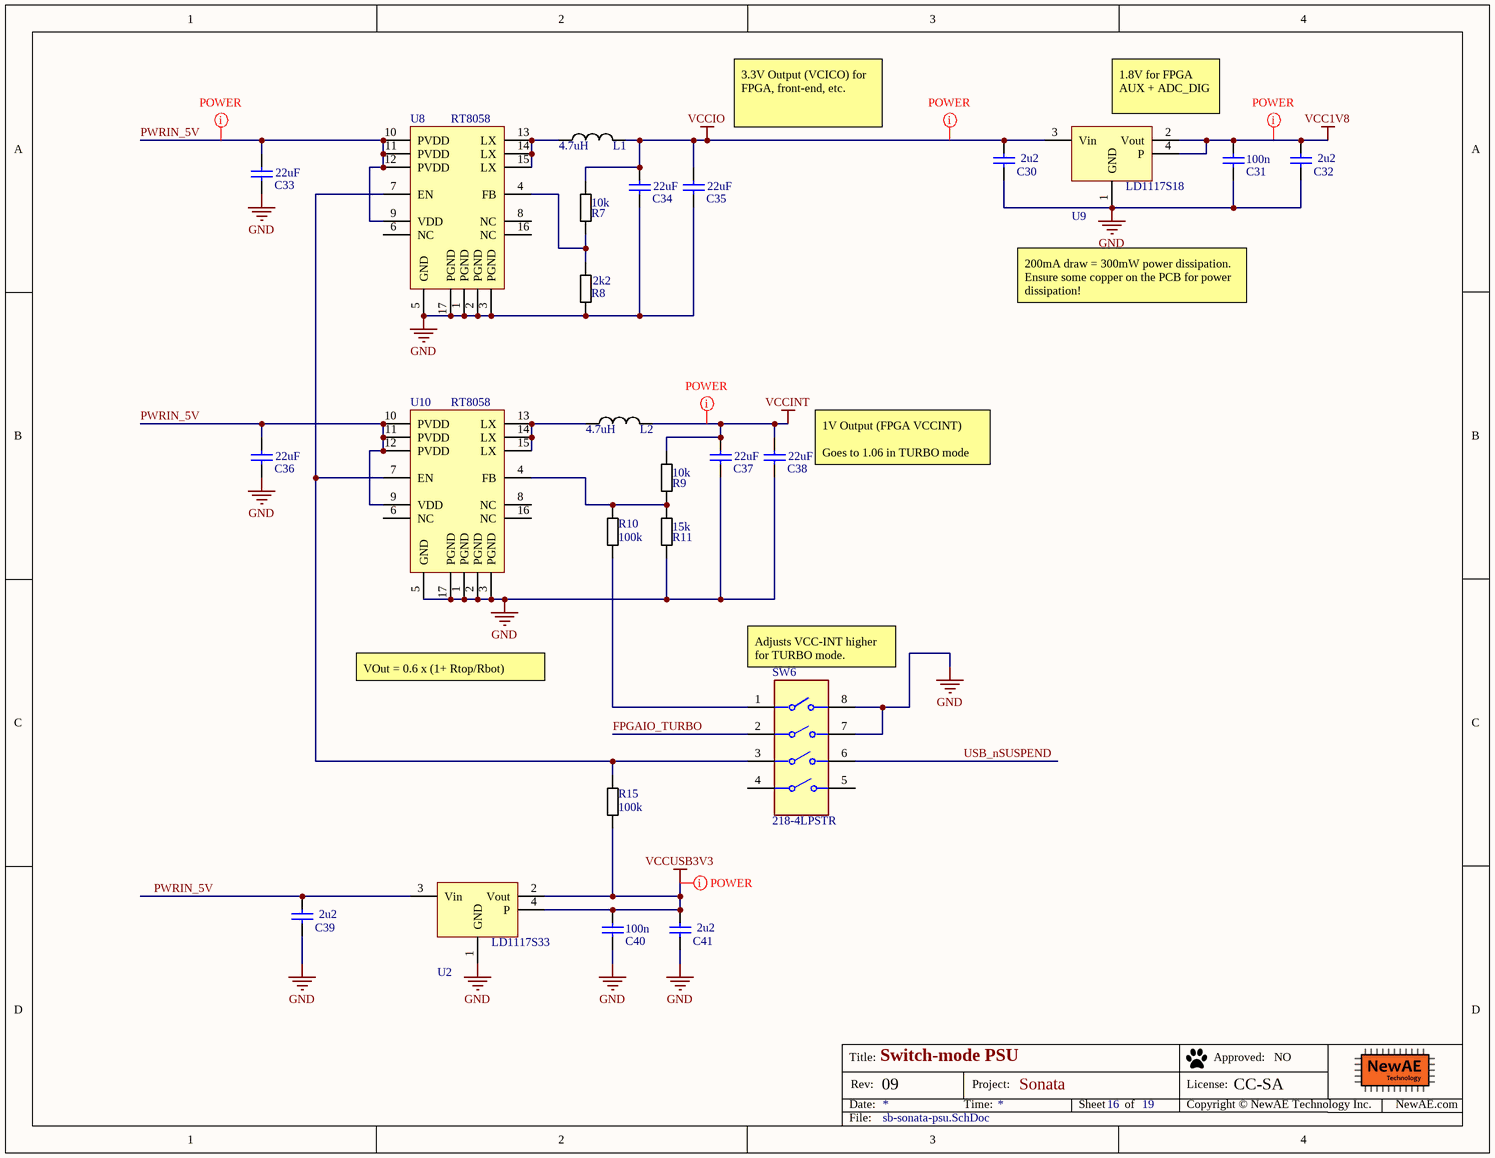
[diagram p16: sb-sonata-psu.SchDoc]

### Parts
C30  2u2  [CAPC0603_M]
C31  100n  [CAPC0402_M]
C32  2u2  [CAPC0603_M]
C33  22uF  [CAPC0805_M]
C34  22uF  [CAPC0805_M]
C35  22uF  [CAPC0805_M]
C36  22uF  [CAPC0805_M]
C37  22uF  [CAPC0805_M]
C38  22uF  [CAPC0805_M]
C39  2u2  [CAPC0603_M]
C40  100n  [CAPC0402_M]
C41  2u2  [CAPC0603_M]
L1  4.7uH  [NR6028]
L2  4.7uH  [NR6028]
R7  10k  [RESC1005X40N]
R8  2k2  [RESC1005X40N]
R9  10k  [RESC1005X40N]
R10  100k  [RESC1005X40N]
R11  15k  [RESC1005X40N]
R15  100k  [RESC1608X55N]
SW6  218-4LPSTR  [FP-218-4LPSTR-MFG]
U2  LD1117S33  [SOT-223]
U8  RT8058  [QFN16_50P300X300X100_HS-17M]
U9  LD1117S18  [SOT-223]
U10  RT8058  [QFN16_50P300X300X100_HS-17M]

### Nets
GND: C30.2 C31.2 C32.2 C33.2 C34.2 C35.2 C36.2 C37.2 C38.2 C39.2 C40.2 C41.2 R8.2 R11.2 SW6.7 SW6.8 U2.1(GND) U8.1(PGND) U8.2(PGND) U8.3(PGND) U8.5(GND) U8.17(PGND) U9.1(GND) U10.1(PGND) U10.2(PGND) U10.3(PGND) U10.5(GND) U10.17(PGND)
VCC1V8: C31.1 C32.1 U9.2(Vout) U9.4(P)
VCCINT: C37.1 C38.1 L2.2 R9.1
VCCIO: C30.1 C34.1 C35.1 L1.2 R7.1 U9.3(Vin)  [project net 3V3_FTDI]
VCCUSB3V3: C40.1 C41.1 R15.1 U2.2(Vout) U2.4(P)
FPGAIO_TURBO: SW6.2
PWRIN_5V: C33.1 C36.1 C39.1 U2.3(Vin) U8.9(VDD) U8.10(PVDD) U8.11(PVDD) U8.12(PVDD) U10.9(VDD) U10.10(PVDD) U10.11(PVDD) U10.12(PVDD)
USB_nSUSPEND: SW6.6
NetL1_1: L1.1 U8.13(LX) U8.14(LX) U8.15(LX)
NetL2_1: L2.1 U10.13(LX) U10.14(LX) U10.15(LX)
NetR7_2: R7.2 R8.1 U8.4(FB)
NetR9_2: R9.2 R10.1 R11.1 U10.4(FB)
NetR10_2: R10.2 SW6.1
NetR15_2: R15.2 SW6.3 U8.7(EN) U10.7(EN)

Not connected (* = marked no-connect by the designer): SW6 4 5; U8 6(NC) 8(NC) 16(NC); U10 6(NC) 8(NC) 16(NC)

### Layout directives
net class Power: 3V3_FTDI, PWRIN_5V, VCC1V8, VCCINT, VCCUSB3V3

### Notes on the sheet
- 3.3V Output (VCICO) for FPGA, front-end, etc.
- 1.8V for FPGA AUX + ADC_DIG
- 200mA draw = 300mW power dissipation. Ensure some copper on the PCB for power dissipation!
- (near C38) 1V Output (FPGA VCCINT)
  Goes to 1.06 in TURBO mode
- VOut = 0.6 x (1+ Rtop/Rbot)
- (near SW6) Adjusts VCC-INT higher for TURBO mode.
- Title:
- Date:
- Rev:
- Time:
- Project:
- Sheet
- of
- License:
- Copyright © NewAE Technology Inc.
- Approved:
- NewAE.com
- File:

### Library data of the parts
C30 C32 C39 C41 = CCHIP-2u2-0603: as C11-C13 on sheet sb-sonata-fpgapwr; Part Number: CCHIP-2u2-0603; Footprint: 0603; Pin Count: 2; Supplier 1: Digi-Key; Supplier Part Number 1: 1276-1134-2-ND; Value: 2u2; Mounting Technology: SMT; Component Kind: Standard; Component Type: Standard
C31 C40 = CCHIP-100n-0402: 100n, 0402; Component Group: Capacitor; Case-EIA: 0402; Part Number: CCHIP-100n-0402; Footprint: 0402; Pin Count: 2; Value: 100n; Mounting Technology: SMT; Component Kind: Standard; Component Type: Standard; Supplier 1: Digi-Key; Supplier Part Number 1: 445-6901-1-ND
C33-C38 = CCHIP-22u-0805-16V: 22u, 16V, 0805, Ceramic; Manufacture 1: Samsung Electro-Mechanics; Manufacture Part Number 1: CL21A226MOCLRNC; Component Group: Capacitor; Case-EIA: 0805; Case-Metric: 1608; Rated Voltage: 16VDC; Tolerance: 20%; Part Number: CCHIP-22u-0805-16V; Footprint: 0805; Pin Count: 2; Supplier 1: Digi-Key; Supplier Part Number 1: 1276-6780-1-ND; Value: 22uF; Mounting Technology: SMT; RoHS: Yes; Component Kind: Standard; Component Type: Standard
L1 L2 = NR6028T4R7M: fixed ind, ferrite, shielded; Manufacture 1: Taiyo Yuden; Component Group: Inductor; Case-Metric: 6060; Part Number: NR6028T4R7M; Footprint: SMD,6x6mm; Manufacture Part Number 1: NR6028T4R7M; Pin Count: 2; Supplier 1: Digi-Key; Supplier Part Number 1: 587-2100-1-ND; Value: 4.7uH; Mounting Technology: SMT; Component Kind: Standard; Component Type: Standard
R7 R9 = RCHIP-10K-0402: 10k res, 0402, 1%, 1/16W; Manufacture 1: Yageo; Manufacture Part Number 1: RC0402FR-0710KL; Component Group: Resistor; Case-EIA: 0402; Case-Metric: 1005; Rated Power: 0.063W; Rated Voltage: 75VDC; Part Number: RCHIP-10K-0402; Footprint: 0402; Pin Count: 2; Supplier 1: Digi-Key; Supplier Part Number 1: 311-10.0KLRCT-ND; Value: 10k; Tolerance: 1%; Mounting Technology: SMT; Temperature Range: -55C to 155C; Component Kind: Standard; Component Type: Standard
R8 = RCHIP-2K2-0402: 2k2 res, 0402, 1%, 1/16W; Manufacture 1: Yageo; Manufacture Part Number 1: RC0402FR-072K2L; Component Group: Resistor; Case-EIA: 0402; Case-Metric: 1005; Rated Power: 0.063W; Rated Voltage: 75VDC; Part Number: RCHIP-2K2-0402; Footprint: 0402; Pin Count: 2; Supplier 1: Digi-Key; Supplier Part Number 1: 311-2.20KLRCT-ND; Value: 2k2; Tolerance: 1%; Mounting Technology: SMT; Temperature Range: -55C to 155C; Component Kind: Standard; Component Type: Standard
R10 = RCHIP-100K-0402: 100k res, 0402, 1%, 1/16W; Manufacture 1: Yageo; Manufacture Part Number 1: RC0402FR-07100KL; Component Group: Resistor; Case-EIA: 0402; Case-Metric: 1005; Rated Power: 0.063W; Rated Voltage: 75VDC; Part Number: RCHIP-100K-0402; Footprint: 0402; Pin Count: 2; Supplier 1: Digi-Key; Supplier Part Number 1: 311-100KLRCT-ND; Value: 100k; Tolerance: 1%; Mounting Technology: SMT; Temperature Range: -55C to 155C; Component Kind: Standard; Component Type: Standard
R11 = RCHIP-15K-0402: 15k res, 0402, 1%, 1/16W; Manufacture 1: Yageo; Manufacture Part Number 1: RC0402FR-0715KL; Component Group: Resistor; Case-EIA: 0402; Case-Metric: 1005; Rated Power: 0.063W; Rated Voltage: 75VDC; Part Number: RCHIP-15K-0402; Footprint: 0402; Pin Count: 2; Supplier 1: Digi-Key; Supplier Part Number 1: 311-15.0KLRCT-ND; Value: 15k; Tolerance: 1%; Mounting Technology: SMT; Temperature Range: -55C to 155C; Component Kind: Standard; Component Type: Standard
R15 = RCHIP-100K-0603: as R75 on sheet sb-sonata-analoginput; Part Number: RCHIP-100K-0603; Footprint: 0603; Pin Count: 2; Supplier 1: Digi-Key; Supplier Part Number 1: 311-100KHRCT-ND; Value: 100k; Tolerance: 1%; Mounting Technology: SMT; Temperature Range: -55C to 155C; Component Kind: Standard; Component Type: Standard
SW6 = CMP-07018-000008-1: SWITCH SLIDE DIP SPST 25MA 24V; Number of Positions: 4; Washable: Yes; Pitch: 0.05inch; Actuator Type: Slide (Standard); Electrical Life: 1000Cycles; Current Rating: 25mA; Contact Material: Copper; Max Current Rating: 25mA; Termination: Gull Wing; Throw Configuration: SPST; Mount: Surface Mount; Radiation Hardening: No; Contact Plating: Gold; Length: 0.246inch; Depth: 8.44mm; Package Quantity: 2000; Packaging: Tape and Reel; Series: 218; Lead Free: Lead Free; Voltage Rating (DC): 24V; Min Operating Temperature: -55°C; RoHS Compliant: Yes; Mechanical Life: 1000Cycles; Max Operating Temperature: 85°C; Orientation: Straight; Max Voltage Rating (DC): 24V
U2 = LD1117S33: IC REG LIN POS 3.3V 800MA SOT223; Manufacture 1: STMicroelectronics; Manufacture Part Number 1: LD1117S33TR; Component Group: Analog IC; Rated Voltage: 15V; PP Material Stack: 0; Part Number: LD1117S33; Pin Count: 3; Supplier 1: Digi-Key; Supplier Part Number 1: 497-1242-1-ND; Mounting Technology: SMT; RoHS: Yes; Component Kind: Standard; Component Type: Standard; PP Rotation: 0
U8 U10 = RT8058: Switching supply controller, 2A; Manufacture 1: Richtek; Component Group: Analog IC; PP Material Stack: 0; Part Number: RT8058; Footprint: QFN16; Manufacture Part Number 1: RT8058; Pin Count: 17; Component Kind: Standard; Component Type: Standard; PP Rotation: 0
U9 = LD1117S18: IC REG LIN POS 1.8V 800MA SOT223; Manufacture 1: STMicroelectronics; Manufacture Part Number 1: LD1117S18TR; Component Group: Analog IC; Rated Voltage: 15V; PP Material Stack: 0; Part Number: LD1117S18; Pin Count: 3; Supplier 1: Digi-Key; Supplier Part Number 1: 497-7308-1-ND; Mounting Technology: SMT; RoHS: Yes; Component Kind: Standard; Component Type: Standard; PP Rotation: 0

## Sheet sb-sonata-usbphy.SchDoc: USB Phy
size Letter; Organization: NewAE Technology Inc.; Address1: 1083 Queen St., Suite 196; Address2: Halifax; Address3: NS; Address4: Canada B3H 0B2; SheetNumber: 18; SheetTotal: 20; SheetApproved: NO
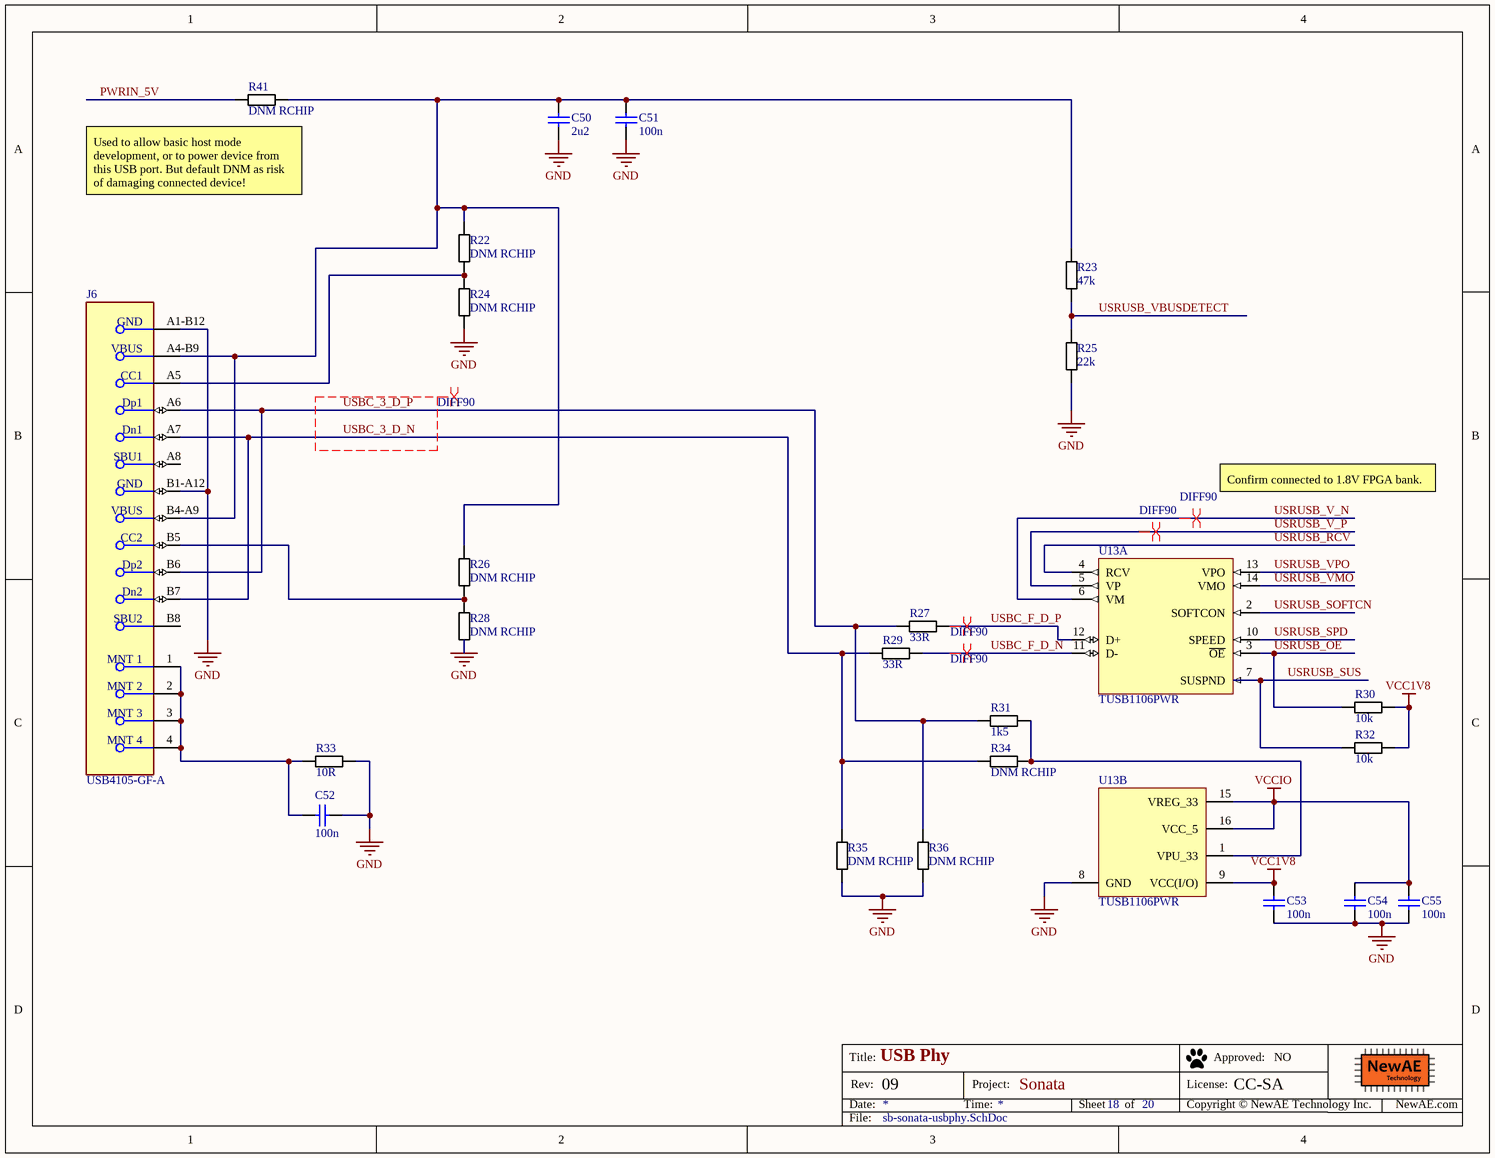
[diagram p17: sb-sonata-usbphy.SchDoc]

### Parts
C50  2u2  [CAPC0603_M]
C51  100n  [CAPC0402_M]
C52  100n  [CAPC0603_M]
C53  100n  [CAPC0402_M]
C54  100n  [CAPC0402_M]
C55  100n  [CAPC0402_M]
J6  USB4105-GF-A  [FP-USB4105-GF-A-MFG]
R22  DNM RCHIP  [RESC1608X55N]
R23  47k  [RESC1005X40N]
R24  DNM RCHIP  [RESC1608X55N]
R25  22k  [RESC1005X40N]
R26  DNM RCHIP  [RESC1608X55N]
R27  33R  [RESC1608X55N]
R28  DNM RCHIP  [RESC1608X55N]
R29  33R  [RESC1608X55N]
R30  10k  [RESC1005X40N]
R31  1k5  [RESC1608X55N]
R32  10k  [RESC1005X40N]
R33  10R  [RESC1608X55N]
R34  DNM RCHIP  [RESC1608X55N]
R35  DNM RCHIP  [RESC1608X55N]
R36  DNM RCHIP  [RESC1608X55N]
R41  DNM RCHIP  [RESC1608X55N]
U13  TUSB1106PWR  [PW0016A_L]  (parts A,B of 2)

### Nets
GND: C50.2 C51.2 C52.2 C53.2 C54.2 C55.2 J6.A1-B12(GND) J6.B1-A12(GND) R24.2 R25.2 R28.2 R33.2 R35.1 R36.1 U13.8(GND)
VCC1V8: C53.1 R30.2 R32.2 U13.9(VCC(I/O))
VCCIO: C54.1 C55.1 U13.15(VREG_33) U13.16(VCC_5)  [project net 3V3_FTDI]
PWRIN_5V: R41.2
USBC_3_D_N: J6.A7(Dn1) J6.B7(Dn2) R29.1 R34.1 R35.2
USBC_3_D_P: J6.A6(Dp1) J6.B6(Dp2) R27.1 R31.1 R36.2
USBC_F_D_N: R29.2 U13.11(D-)
USBC_F_D_P: R27.2 U13.12(D+)
USRUSB_OE: R30.1 U13.3(~{OE})
USRUSB_RCV: U13.4(RCV)
USRUSB_SOFTCN: U13.2(SOFTCON)
USRUSB_SPD: U13.10(SPEED)
USRUSB_SUS: R32.1 U13.7(SUSPND)
USRUSB_V_N: U13.6(VM)
USRUSB_V_P: U13.5(VP)
USRUSB_VBUSDETECT: R23.2 R25.1
USRUSB_VMO: U13.14(VMO)
USRUSB_VPO: U13.13(VPO)
NetC50_1: C50.1 C51.1 J6.A4-B9(VBUS) J6.B4-A9(VBUS) R22.1 R23.1 R26.1 R41.1
NetC52_1: C52.1 J6.1(MNT_1) J6.2(MNT_2) J6.3(MNT_3) J6.4(MNT_4) R33.1
NetJ6_A5: J6.A5(CC1) R22.2 R24.1
NetJ6_B5: J6.B5(CC2) R26.2 R28.1
NetR31_2: R31.2 R34.2 U13.1(VPU_33)

Not connected (* = marked no-connect by the designer): J6 A8(SBU1) B8(SBU2)

### Layout directives
differential pair; differential pair class DIFF90: USBC_3_D_N, USBC_3_D_P, USBC_F_D_N, USBC_F_D_P, USRUSB_V_N, USRUSB_V_P

### Notes on the sheet
- (near R41) Used to allow basic host mode development, or to power device from this USB port. But default DNM as risk of damaging connected device!
- Confirm connected to 1.8V FPGA bank.
- Title:
- Date:
- Rev:
- Time:
- Project:
- Sheet
- of
- License:
- Copyright © NewAE Technology Inc.
- Approved:
- NewAE.com
- File:

### Library data of the parts
C50 = CCHIP-2u2-0603: as C11-C13 on sheet sb-sonata-fpgapwr; Part Number: CCHIP-2u2-0603; Footprint: 0603; Pin Count: 2; Supplier 1: Digi-Key; Supplier Part Number 1: 1276-1134-1-ND; Value: 2u2; Mounting Technology: SMT; Component Kind: Standard; Component Type: Standard
C51 C53-C55 = CCHIP-100n-0402: as C6 on sheet sb-sonata-fpgapwr; Part Number: CCHIP-100n-0402; Footprint: 0402; Pin Count: 2; Value: 100n; Mounting Technology: SMT; Component Kind: Standard; Component Type: Standard; Supplier 1: Digi-Key; Supplier Part Number 1: 445-6901-1-ND
C52 = CCHIP-100n-0603: 100n, 0603; Manufacture 1: Kemet; Manufacture Part Number 1: C0603C104K5RACTU; Component Group: Capacitor; Case-EIA: 0603; Case-Metric: 1608; Rated Voltage: 50VDC; Part Number: CCHIP-100n-0603; Footprint: 0603; Pin Count: 2; Supplier 1: Digi-Key; Supplier Part Number 1: 399-5089-2-ND; Value: 100n; Mounting Technology: SMT; Component Kind: Standard; Component Type: Standard
J6 = CMP-245163-000001-1: CONN RCPT USB2.0 TYPEC 5A; Manufacturer: GCT; Voltage Rating: 20V; Is Female: yes; Current Rating: 5/6.25/1.25/0.25A; Number Of Contacts: 16; Conn Orientation: Right Angle; Device Class L1: Connectors; Category: Conn; Lead Free: Yes; RoHS: TRUE; Temperature Range High: +85°C; Digikey Description: CONN RCPT USB2.0 TYPEC 5A; Device Class L3: unset; ComponentLink2Description: Datasheet; Manufacturer Part Number: USB4105-GF-A; Package: 0; Usb Standard: USB 2.0; Device Class L2: USB Connectors; Automotive: No; Temperature Range Low: -40°C; Height: 3.46mm; Temperature: -40°C to +85°C; Contact Material: Gold,Nickel; ComponentLink2URL: https://gct.co/files/drawings/usb4105.pdf; Octopart: https://octopart.com/usb4105-gf-a-gct-106627878
R22 R24 R26 R28 R34-R36 R41 = RCHIP-DNM-0603: Do Not Mount Resistor; Case-EIA: 0603; Case-Metric: 1608; Part Number: RCHIP-DNM-0603; Component Group: Resistor; Footprint: 0603; Pin Count: 2; Mounting Technology: SMT; Component Kind: Standard; Component Type: Standard
R23 = RCHIP-47K-0402: 47k res, 0402, 1%, 1/16W; Manufacture 1: Yageo; Manufacture Part Number 1: RC0402FR-0747KL; Component Group: Resistor; Case-EIA: 0402; Case-Metric: 1005; Rated Power: 0.063W; Rated Voltage: 75VDC; Part Number: RCHIP-47K-0402; Footprint: 0402; Pin Count: 2; Supplier 1: Digi-Key; Supplier Part Number 1: 311-47.0KLRCT-ND; Value: 47k; Tolerance: 1%; Mounting Technology: SMT; Temperature Range: -55C to 155C; Component Kind: Standard; Component Type: Standard
R25 = RCHIP-22K-0402: 22k res, 0402, 1%, 1/16W; Manufacture 1: Yageo; Manufacture Part Number 1: RC0402FR-0722KL; Component Group: Resistor; Case-EIA: 0402; Case-Metric: 1005; Rated Power: 0.063W; Rated Voltage: 75VDC; Part Number: RCHIP-22K-0402; Footprint: 0402; Pin Count: 2; Supplier 1: Digi-Key; Supplier Part Number 1: 311-22.0KLRCT-ND; Value: 22k; Tolerance: 1%; Mounting Technology: SMT; Temperature Range: -55C to 155C; Component Kind: Standard; Component Type: Standard
R27 R29 = RCHIP-33R-0603: 33R res, 0603, 1%, 1/10W; Manufacture 1: Yageo; Manufacture Part Number 1: RC0603FR-0733RL; Component Group: Resistor; Case-EIA: 0603; Case-Metric: 1608; Rated Power: 0.1W; Rated Voltage: 75VDC; Part Number: RCHIP-33R-0603; Footprint: 0603; Pin Count: 2; Supplier 1: Digi-Key; Supplier Part Number 1: 311-33.0HRCT-ND; Value: 33R; Tolerance: 1%; Mounting Technology: SMT; Temperature Range: -55C to 155C; Component Kind: Standard; Component Type: Standard
R30 R32 = RCHIP-10K-0402: as R7 on sheet sb-sonata-psu; Part Number: RCHIP-10K-0402; Footprint: 0402; Pin Count: 2; Supplier 1: Digi-Key; Supplier Part Number 1: 311-10.0KLRCT-ND; Value: 10k; Tolerance: 1%; Mounting Technology: SMT; Temperature Range: -55C to 155C; Component Kind: Standard; Component Type: Standard
R31 = RCHIP-1K5-0603: 1k5 res, 0603, 1%, 1/10W; Manufacture 1: Yageo; Manufacture Part Number 1: RC0603FR-071K5L; Component Group: Resistor; Case-EIA: 0603; Case-Metric: 1608; Rated Power: 0.1W; Rated Voltage: 75VDC; Part Number: RCHIP-1K5-0603; Footprint: 0603; Pin Count: 2; Supplier 1: Digi-Key; Supplier Part Number 1: 311-1.50KHRCT-ND; Value: 1k5; Tolerance: 1%; Mounting Technology: SMT; Temperature Range: -55C to 155C; Component Kind: Standard; Component Type: Standard
R33 = RCHIP-10R-0603: as R82 on sheet sb-sonata-analoginput; Part Number: RCHIP-10R-0603; Footprint: 0603; Pin Count: 2; Supplier 1: Digi-Key; Supplier Part Number 1: 311-10.0HRCT-ND; Value: 10R; Tolerance: 1%; Mounting Technology: SMT; Temperature Range: -55C to 155C; Component Kind: Standard; Component Type: Standard
U13 = CMP-0309-00090-2: Advanced USB Transciever, Full Speed, Differential, +/-15 KV, -40 to 85 degC, 16-Pin TSSOP (PW), Green (RoHS & no Sb/Br); Manufacturer: Texas Instruments; SubFamily: USB Transceiver; Eco-Plan: Green (RoHS & no Sb/Br); Mounting Technology: Surface Mount; USB Speed: Full; ComponentLink2URL: http://www.ti.com/lit/ml/mpds361/mpds361.pdf; PackageDescription: 16-Pin Plastic Thin Small Outline Package 5 x 4.4 mm Body ,0.65 mm Pitch; ComponentLink1URL: http://www.ti.com/general/docs/lit/getliterature.tsp?genericPartNumber=TUSB1106&fileType=pdf; DatasheetVersion: SCAS818E; PartNumber: TUSB1106PWR; PackageVersion: revG, Feb-2011; PackageReference: PW0016A; ComponentLink2Description: Package Specification; ESD HBM(kV): +/-15; Code_JEDEC: MO-153; ComponentLink1Description: Datasheet